# Altium schematic sheet Controller.SchDoc
size A3
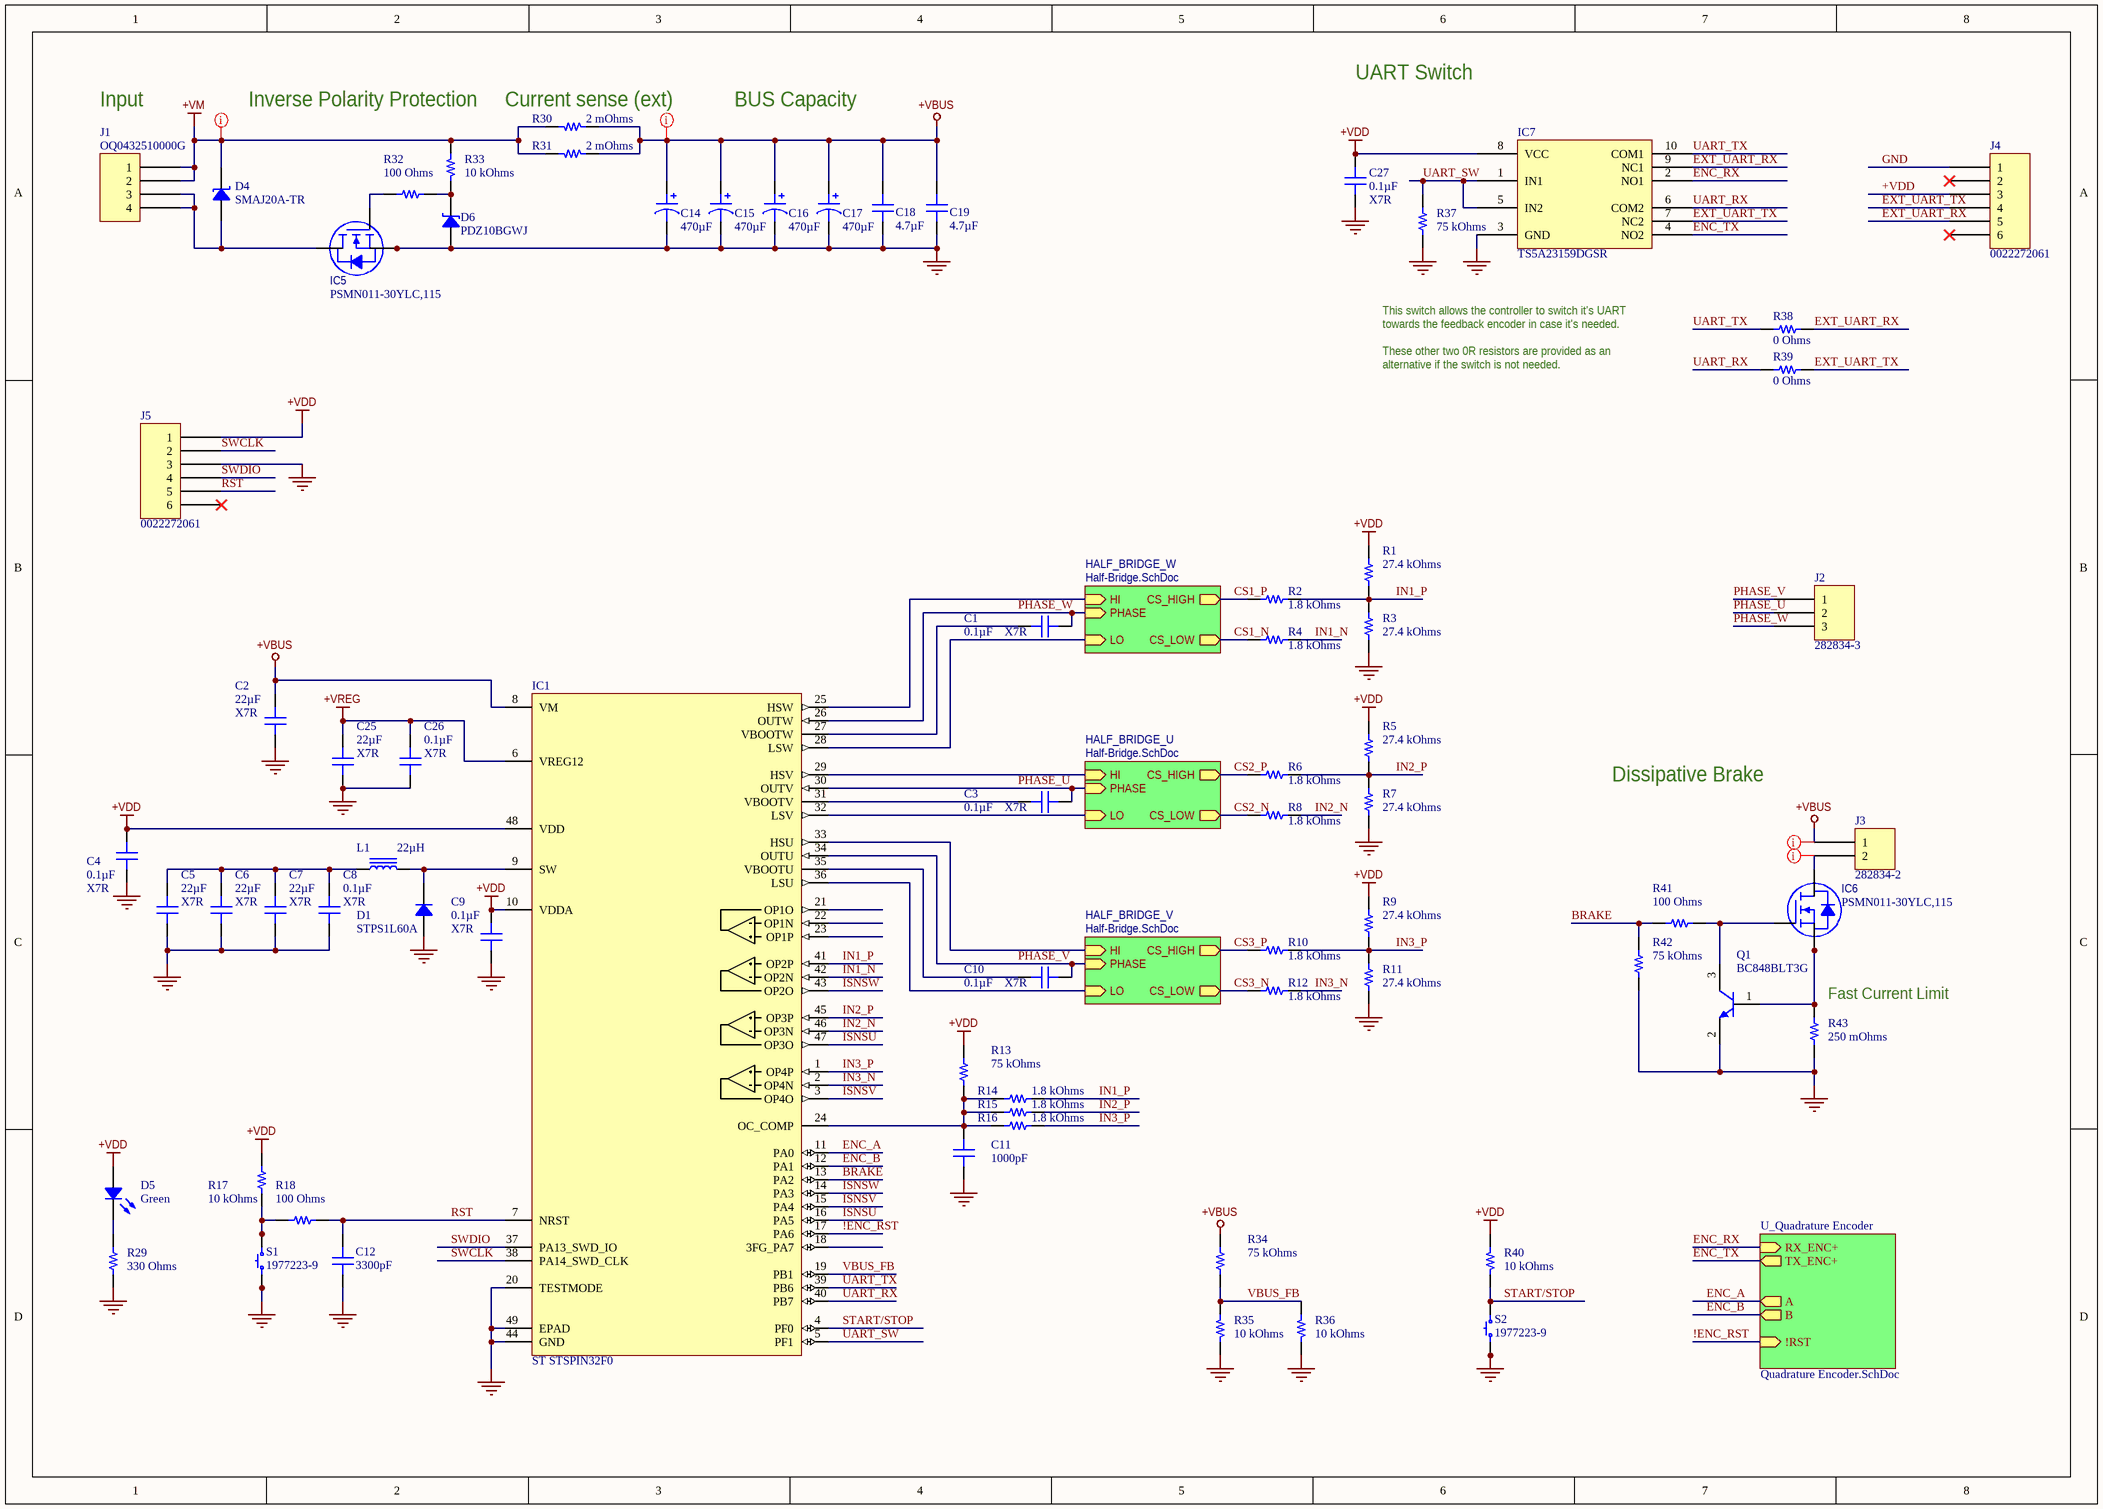
[diagram p0: Controller.SchDoc]

## Parts
C1  Temperature Coefficient: X7R  [CAP 0805_2012]  (hidden comment: 0.1µF)
C2  Temperature Coefficient: X7R  [CAP 1206_3216 - 1.8MM]  (hidden comment: 22µF)
C3  Temperature Coefficient: X7R  [CAP 0805_2012]  (hidden comment: 0.1µF)
C4  Temperature Coefficient: X7R  [CAP 0805_2012]  (hidden comment: 0.1µF)
C5  Temperature Coefficient: X7R  [CAP 1206_3216 - 1.8MM]  (hidden comment: 22µF)
C6  Temperature Coefficient: X7R  [CAP 1206_3216 - 1.8MM]  (hidden comment: 22µF)
C7  Temperature Coefficient: X7R  [CAP 1206_3216 - 1.8MM]  (hidden comment: 22µF)
C8  Temperature Coefficient: X7R  [CAP 0805_2012]  (hidden comment: 0.1µF)
C9  Temperature Coefficient: X7R  [CAP 0805_2012]  (hidden comment: 0.1µF)
C10  Temperature Coefficient: X7R  [CAP 0805_2012]  (hidden comment: 0.1µF)
C11  1000pF  [CAP 0603_1608]
C12  3300pF  [CAP 0603_1608]
C14  470µF  [CAP ALSMD 8.3MM H10.5MM]
C15  470µF  [CAP ALSMD 8.3MM H10.5MM]
C16  470µF  [CAP ALSMD 8.3MM H10.5MM]
C17  470µF  [CAP ALSMD 8.3MM H10.5MM]
C18  4.7µF  [CAP 1206_3216 - 1.8MM]
C19  4.7µF  [CAP 1206_3216 - 1.8MM]
C25  Temperature Coefficient: X7R  [CAP 1206_3216 - 1.8MM]  (hidden comment: 22µF)
C26  Temperature Coefficient: X7R  [CAP 0805_2012]  (hidden comment: 0.1µF)
C27  Temperature Coefficient: X7R  [CAP 0805_2012]  (hidden comment: 0.1µF)
D1  STPS1L60A  [DO214AC SMA]
D4  SMAJ20A-TR  [DO214AC SMA]
D5  Green  [LED 0603_1608 GREEN]
D6  PDZ10BGWJ  [SOD-123]
IC1  ST STSPIN32F0  [ST VFQFPN48EP 7x7MM]
IC5  PSMN011-30YLC,115  [NXP LFPAK56 SOT669]
IC6  PSMN011-30YLC,115  [NXP LFPAK56 SOT669]
IC7  TS5A23159DGSR  [TI MSOP-10 DGS]
J1  OQ0432510000G  [FCI 06-381-4PIN]
J2  282834-3  [TE 282834-3]
J3  282834-2  [TE 282834-2]
J4  0022272061  [MOLEX KK 0022272061]
J5  0022272061  [MOLEX KK 0022272061]
L1  22µH  [BOURNS SRN3015]
Q1  BC848BLT3G  [ON SEMI SOT-23-3]
R1  27.4 kOhms  [RES 0603_1608]
R2  1.8 kOhms  [RES 0603_1608]
R3  27.4 kOhms  [RES 0603_1608]
R4  1.8 kOhms  [RES 0603_1608]
R5  27.4 kOhms  [RES 0603_1608]
R6  1.8 kOhms  [RES 0603_1608]
R7  27.4 kOhms  [RES 0603_1608]
R8  1.8 kOhms  [RES 0603_1608]
R9  27.4 kOhms  [RES 0603_1608]
R10  1.8 kOhms  [RES 0603_1608]
R11  27.4 kOhms  [RES 0603_1608]
R12  1.8 kOhms  [RES 0603_1608]
R13  75 kOhms  [RES 0603_1608]
R14  1.8 kOhms  [RES 0603_1608]
R15  1.8 kOhms  [RES 0603_1608]
R16  1.8 kOhms  [RES 0603_1608]
R17  10 kOhms  [RES 0603_1608]
R18  100 Ohms  [RES 0603_1608]
R29  330 Ohms  [RES 0603_1608]
R30  2 mOhms  [RES 1210_3225]
R31  2 mOhms  [RES 1210_3225]
R32  100 Ohms  [RES 0603_1608]
R33  10 kOhms  [RES 0603_1608]
R34  75 kOhms  [RES 0603_1608]
R35  10 kOhms  [RES 0603_1608]
R36  10 kOhms  [RES 0603_1608]
R37  75 kOhms  [RES 0603_1608]
R38  0 Ohms  [RES 0603_1608]
R39  0 Ohms  [RES 0603_1608]
R40  10 kOhms  [RES 0603_1608]
R41  100 Ohms  [RES 0603_1608]
R42  75 kOhms  [RES 0603_1608]
R43  250 mOhms  [RES 2512_6432]
S1  1977223-9  [TE FSM4JSMA]
S2  1977223-9  [TE FSM4JSMA]

## Sub-sheets
HALF_BRIDGE_U = Half-Bridge.SchDoc: CS_HIGH (out), CS_LOW (out), HI (in), LO (in), PHASE (in)
HALF_BRIDGE_V = Half-Bridge.SchDoc: CS_HIGH (out), CS_LOW (out), HI (in), LO (in), PHASE (in)
HALF_BRIDGE_W = Half-Bridge.SchDoc: CS_HIGH (out), CS_LOW (out), HI (in), LO (in), PHASE (in)
U_Quadrature Encoder = Quadrature Encoder.SchDoc: A (out), RX_ENC+ (in), B (out), TX_ENC+ (out), !RST (in)

## Nets
+VBUS: C2.2 C14.1 C15.1 C16.1 C17.1 C18.2 C19.2 IC1.8(VM) J3.1 R30.1 R31.1 R34.2
+VDD: C4.1 C9.1 C27.1 D5.1 IC1.10(VDDA) IC1.48(VDD) IC7.8(VCC) J4.3 J5.1 R1.2 R5.2 R9.2 R13.2 R17.2 R40.2
+VM: D4.2 J1.1 J1.2 R30.2 R31.2 R33.2
+VREG: C25.2 C26.1 IC1.6(VREG12)
GND: C2.1 C4.2 C5.1 C6.1 C7.1 C8.2 C9.2 C11.1 C12.1 C14.2 C15.2 C16.2 C17.2 C18.1 C19.1 C25.1 C26.2 C27.2 D1.1 D6.1 IC1.20(TESTMODE) IC1.44(GND) IC1.49(EPAD) IC5.1(S) IC5.2(S) IC5.3(S) IC7.3(GND) J4.1 J5.3 Q1.2(E) R3.1 R7.1 R11.1 R29.1 R35.1 R36.1 R37.1 R42.1 R43.1 S1.1 S1.2 S2.1 S2.2
!ENC_RST: IC1.17(PA6) ; sheet U_Quadrature Encoder/!RST
BRAKE: IC1.13(PA2) R41.1 R42.2
CS1_N: R4.1 ; sheet HALF_BRIDGE_W/CS_LOW
CS1_P: R2.1 ; sheet HALF_BRIDGE_W/CS_HIGH
CS2_N: R8.1 ; sheet HALF_BRIDGE_U/CS_LOW
CS2_P: R6.1 ; sheet HALF_BRIDGE_U/CS_HIGH
CS3_N: R12.1 ; sheet HALF_BRIDGE_V/CS_LOW
CS3_P: R10.1 ; sheet HALF_BRIDGE_V/CS_HIGH
ENC_A: IC1.11(PA0) ; sheet U_Quadrature Encoder/A
ENC_B: IC1.12(PA1) ; sheet U_Quadrature Encoder/B
ENC_RX: IC7.2(NO1) ; sheet U_Quadrature Encoder/RX_ENC+
ENC_TX: IC7.4(NO2) ; sheet U_Quadrature Encoder/TX_ENC+
EXT_UART_RX: IC7.9(NC1) J4.5 R38.2
EXT_UART_TX: IC7.7(NC2) J4.4 R39.2
IN1_N: IC1.42(OP2N) R4.2
IN1_P: IC1.41(OP2P) R1.1 R2.2 R3.2 R14.2
IN2_N: IC1.46(OP3N) R8.2
IN2_P: IC1.45(OP3P) R5.1 R6.2 R7.2 R15.2
IN3_N: IC1.2(OP4N) R12.2
IN3_P: IC1.1(OP4P) R9.1 R10.2 R11.2 R16.2
ISNSU: IC1.16(PA5) IC1.47(OP3O)
ISNSV: IC1.3(OP4O) IC1.15(PA4)
ISNSW: IC1.14(PA3) IC1.43(OP2O)
PHASE_U: C3.1 IC1.30(OUTV) J2.2 ; sheet HALF_BRIDGE_U/PHASE
PHASE_V: C10.1 IC1.34(OUTU) J2.1 ; sheet HALF_BRIDGE_V/PHASE
PHASE_W: C1.1 IC1.26(OUTW) J2.3 ; sheet HALF_BRIDGE_W/PHASE
RST: C12.2 IC1.7(NRST) J5.5 R18.2
START/STOP: IC1.4(PF0) R40.1 S2.3 S2.4
SWCLK: IC1.38(PA14_SWD_CLK) J5.2
SWDIO: IC1.37(PA13_SWD_IO) J5.4
UART_RX: IC1.40(PB7) IC7.6(COM2) R39.1
UART_SW: IC1.5(PF1) IC7.1(IN1) IC7.5(IN2) R37.2
UART_TX: IC1.39(PB6) IC7.10(COM1) R38.1
VBUS_FB: IC1.19(PB1) R34.1 R35.2 R36.2
NetC1_2: C1.2 IC1.27(VBOOTW)
NetC3_2: C3.2 IC1.31(VBOOTV)
NetC5_2: C5.2 C6.2 C7.2 C8.1 L1.1
NetC10_2: C10.2 IC1.35(VBOOTU)
NetC11_2: C11.2 IC1.24(OC_COMP) R13.1 R14.1 R15.1 R16.1
NetD1_2: D1.2 IC1.9(SW) L1.2
NetD4_1: D4.1 IC5.5(D) J1.3 J1.4
NetD5_2: D5.2 R29.2
NetD6_2: D6.2 R32.2 R33.1
NetIC1_25: IC1.25(HSW) ; sheet HALF_BRIDGE_W/HI
NetIC1_28: IC1.28(LSW) ; sheet HALF_BRIDGE_W/LO
NetIC1_29: IC1.29(HSV) ; sheet HALF_BRIDGE_U/HI
NetIC1_32: IC1.32(LSV) ; sheet HALF_BRIDGE_U/LO
NetIC1_33: IC1.33(HSU) ; sheet HALF_BRIDGE_V/HI
NetIC1_36: IC1.36(LSU) ; sheet HALF_BRIDGE_V/LO
NetIC5_4: IC5.4(G) R32.1
NetIC6_1: IC6.1(S) IC6.2(S) IC6.3(S) Q1.1(B) R43.2
NetIC6_4: IC6.4(G) Q1.3(C) R41.2
NetIC6_5: IC6.5(D) J3.2
NetR17_1: R17.1 R18.1 S1.3 S1.4

Not connected (* = marked no-connect by the designer): IC1 18(3FG_PA7) 21(OP1O) 22(OP1N) 23(OP1P); J4 2* 6*; J5 6*

## Layout directives
net class HIGH_V: +VBUS, +VM, NetIC6_5

## Notes on the sheet
- Input
- (near R30) Inverse Polarity Protection
- (near R30) Current sense (ext)
- BUS Capacity
- UART Switch
- This switch allows the controller to switch it's UART towards the feedback encoder in case it's needed.
  These other two 0R resistors are provided as an alternative if the switch is not needed.
- Dissipative Brake
- (near R43) Fast Current Limit

## Library data of the parts
C1 C3 C4 C8-C10 C26 C27 = CL21B104KBCWPNC: CAP CER 0.1UF 50V X7R 0805; Manufacturer: Samsung Electro-Mechanics; Tolerance: ±10%; Part Number: CL21B104KBCWPNC; Value: 0.1µF; Applications: Automotive; Capacitance: 0.1µF; ComponentLink1Description: Datasheet; ComponentLink1URL: http://www.samsungsem.com/kr/support/product-search/mlcc/CL21B104KBCWPNC.jsp; ComponentLink2Description: DigiKey Link; ComponentLink2URL: http://digikey.com/product-detail/en/samsung-electro-mechanics/CL21B104KBCWPNC/1276-6557-1-ND/5961416; Device Package: 0805 (2012 Metric); Features: Open Mode; LastUpdated: 8/13/2020 10:31:23 AM; Lifecycle Status: Active; Minimum Order: 1; Mounting Type: Surface Mount, MLCC; Operating Temperature: -55°C ~ 125°C; Package / Case: 0805 (2012 Metric); Packaging: TapeAndReel; PartId: 6329; Part Status: Active; Price: 0.01; Ratings: AEC-Q200; Series: CL; Size / Dimension: 0.079" L x 0.049" W (2.00mm x 1.25mm); Supplier 1: DigiKey; Supplier Part Number 1: 1276-6557-1-ND; Thickness (Max): 0.053" (1.35mm)
C2 C5-C7 C25 = GCM31CR70J226KE23L: CAP CER 22UF 6.3V X7R 1206; Manufacturer: Murata Electronics; Tolerance: ±10%; Part Number: GCM31CR70J226KE23L; Value: 22µF; Applications: Automotive; Capacitance: 22µF; ComponentLink1Description: Datasheet; ComponentLink1URL: https://www.murata.com/~/media/webrenewal/support/library/catalog/products/capacitor/mlcc/c03e.ashx?la=en-us; ComponentLink2Description: DigiKey Link; ComponentLink2URL: http://digikey.com/product-detail/en/murata-electronics/GCM31CR70J226KE23L/490-4843-1-ND/1763981; Device Package: 1206 (3216 Metric); LastUpdated: 9/2/2020 1:05:42 AM; Lifecycle Status: Active; Minimum Order: 1; Mounting Type: Surface Mount, MLCC; Operating Temperature: -55°C ~ 125°C; Package / Case: 1206 (3216 Metric); Packaging: TapeAndReel; PartId: 19505; Part Status: Active; Price: 0.23; Ratings: AEC-Q200; Series: GCM; Size / Dimension: 0.126" L x 0.063" W (3.20mm x 1.60mm); Supplier 1: DigiKey; Supplier Part Number 1: 490-4843-1-ND; Thickness (Max): 0.071" (1.80mm); Voltage - Rated: 6.3V
C11 = C0603C102K4RECAUTO: CAP CER 0603 1NF 16V X7R 10%; Manufacturer: KEMET; Part Number: C0603C102K4RECAUTO; Value: 1000pF; Applications: Automotive, ESD Protection; Capacitance: 1000pF; ComponentLink1Description: Datasheet; ComponentLink1URL: https://api.kemet.com/component-edge/download/datasheet/C0603C102K4RECAUTO.pdf; ComponentLink2Description: DigiKey Link; ComponentLink2URL: http://digikey.com/product-detail/en/kemet/C0603C102K4RECAUTO/399-17878-1-ND/8640545; Device Package: 0603 (1608 Metric); LastUpdated: 9/2/2020 1:03:36 AM; Lifecycle Status: Active; Minimum Order: 1; Mounting Type: Surface Mount, MLCC; Operating Temperature: -55°C ~ 125°C; Package / Case: 0603 (1608 Metric); Packaging: TapeAndReel; PartId: 2316; Part Status: Active; Price: 0.02; Ratings: AEC-Q200; Series: ESD SMD Auto X7R; Size / Dimension: 0.063" L x 0.031" W (1.60mm x 0.80mm); Supplier 1: DigiKey; Supplier Part Number 1: 399-17878-1-ND; Temperature Coefficient: X7R; Thickness (Max): 0.034" (0.87mm); Tolerance: ±10%; Voltage - Rated: 16V
C12 = C0603C332J3GAC7867: CAP CER 3300PF 25V NP0 0603; Manufacturer: KEMET; Temperature Coefficient: C0G, NP0; Tolerance: ±5%; Part Number: C0603C332J3GAC7867; Value: 3300pF; Applications: General Purpose; Capacitance: 3300pF; ComponentLink1Description: Datasheet; ComponentLink1URL: https://api.kemet.com/component-edge/download/datasheet/C0603C332J3GACTU.pdf; ComponentLink2Description: DigiKey Link; ComponentLink2URL: http://digikey.com/product-detail/en/kemet/C0603C332J3GAC7867/399-15394-1-ND/7386792; Device Package: 0603 (1608 Metric); Features: Low ESL; LastUpdated: 9/2/2020 1:03:35 AM; Lifecycle Status: Active; Minimum Order: 1; Mounting Type: Surface Mount, MLCC; Operating Temperature: -55°C ~ 125°C; Package / Case: 0603 (1608 Metric); Packaging: TapeAndReel; PartId: 2363; Part Status: Active; Price: 0.08; Series: SMD Comm C0G; Size / Dimension: 0.063" L x 0.031" W (1.60mm x 0.80mm); Supplier 1: DigiKey; Supplier Part Number 1: 399-15394-1-ND; Thickness (Max): 0.034" (0.87mm); Voltage - Rated: 25V
C14-C17 = 25TPV470M8X10.5: CAP ALUM 470UF 20% 25V SMD; Manufacturer: Rubycon; ESR (Equivalent Series Resistance): 80mOhm @ 100kHz; Lifetime @ Temp.: 2000 Hrs @ 105°C; Polarization: Polar; Ripple Current @ High Frequency: 850mA @ 100kHz; Ripple Current @ Low Frequency: 510mA @ 120Hz; Surface Mount Land Size: 0.327" L x 0.327" W (8.30mm x 8.30mm); Part Number: 25TPV470M8X10.5; Applications: Automotive; Capacitance: 470µF; ComponentLink1Description: Datasheet; ComponentLink1URL: http://www.rubycon.co.jp/en/catalog/e_pdfs/aluminum/e_TPV.pdf; ComponentLink2Description: DigiKey Link; ComponentLink2URL: http://digikey.com/product-detail/en/rubycon/25TPV470M8X10.5/1189-4137-1-ND/9083593; Device Package: Radial, Can - SMD; Height - Seated (Max): 0.413" (10.50mm); LastUpdated: 9/2/2020 1:25:13 AM; Lifecycle Status: Active; Minimum Order: 1; Mounting Type: Surface Mount; Operating Temperature: -55°C ~ 105°C; Package / Case: Radial, Can - SMD; Packaging: TapeAndReel; PartId: 7752; Part Status: Active; Price: 0.42; Ratings: AEC-Q200; Series: TPV; Size / Dimension: 0.315" Dia (8.00mm); Supplier 1: DigiKey; Supplier Part Number 1: 1189-4137-1-ND; Tolerance: ±20%; Value: 470µF; Voltage - Rated: 25V
C18 C19 = GCM31CR71E475KA55L: CAP CER 4.7UF 25V X7R 1206; Manufacturer: Murata Electronics; Tolerance: ±10%; Part Number: GCM31CR71E475KA55L; Value: 4.7µF; Applications: Automotive; Capacitance: 4.7µF; ComponentLink1Description: Datasheet; ComponentLink1URL: https://www.murata.com/~/media/webrenewal/support/library/catalog/products/capacitor/mlcc/c03e.ashx?la=en-us; ComponentLink2Description: DigiKey Link; ComponentLink2URL: http://digikey.com/product-detail/en/murata-electronics/GCM31CR71E475KA55L/490-4794-1-ND/1641713; Device Package: 1206 (3216 Metric); LastUpdated: 9/2/2020 1:05:30 AM; Lifecycle Status: Active; Minimum Order: 1; Mounting Type: Surface Mount, MLCC; Operating Temperature: -55°C ~ 125°C; Package / Case: 1206 (3216 Metric); Packaging: TapeAndReel; PartId: 21968; Part Status: Active; Price: 0.16; Ratings: AEC-Q200; Series: GCM; Size / Dimension: 0.126" L x 0.063" W (3.20mm x 1.60mm); Supplier 1: DigiKey; Supplier Part Number 1: 490-4794-1-ND; Temperature Coefficient: X7R; Thickness (Max): 0.071" (1.80mm); Voltage - Rated: 25V
D1 = STPS1L60A: DIODE SCHOTTKY 60V 1A SMA; Manufacturer: STMicroelectronics; Current - Reverse Leakage @ Vr: 50µA @ 60V; Speed: Fast Recovery =< 500ns, > 200mA (Io); Voltage - Forward (Vf) (Max) @ If: 570mV @ 1A; Part Number: STPS1L60A; ComponentLink1Description: Datasheet; ComponentLink1URL: http://www.st.com/content/ccc/resource/technical/document/datasheet/group1/7e/b6/29/85/66/15/45/f3/CD00002285/files/CD00002285.pdf/jcr:content/translations/en.CD00002285.pdf; ComponentLink2Description: DigiKey Link; ComponentLink2URL: http://digikey.com/product-detail/en/stmicroelectronics/STPS1L60A/497-2463-1-ND/603845; Current - Average Rectified (Io): 1A; Diode Type: Schottky; LastUpdated: 9/2/2020 1:19:02 AM; Lifecycle Status: Active; Minimum Order: 1; Mounting Type: Surface Mount; Operating Temperature - Junction: 150°C (Max); Package / Case: DO-214AC, SMA; Packaging: TapeAndReel; PartId: 2097; Part Status: Active; Price: 0.14; Series: -; Supplier 1: DigiKey; Supplier Part Number 1: 497-2463-1-ND; Supplier Device Package: SMA (DO-214AC); Voltage - DC Reverse (Vr) (Max): 60V
D4 = SMAJ20A-TR: TVS DIODE 20V 42.8V SMA; Manufacturer: STMicroelectronics; Current - Peak Pulse (10/1000µs): 54A (8/20µs); Power Line Protection: No; Power - Peak Pulse: 400W; Type: Zener; Unidirectional Channels: 1; Voltage - Breakdown (Min): 22.2V; Part Number: SMAJ20A-TR; Applications: General Purpose; ComponentLink1Description: Datasheet; ComponentLink1URL: http://www.st.com/content/ccc/resource/technical/document/datasheet/ff/c0/80/cc/19/4c/45/af/CD00001333.pdf/files/CD00001333.pdf/_jcr_content/translations/en.CD00001333.pdf; ComponentLink2Description: DigiKey Link; ComponentLink2URL: http://digikey.com/product-detail/en/stmicroelectronics/SMAJ20A-TR/497-16189-1-ND/5764818; LastUpdated: 9/2/2020 1:20:15 AM; Lifecycle Status: Active; Minimum Order: 1; Mounting Type: Surface Mount; Operating Temperature: -55°C ~ 150°C (TJ); Package / Case: DO-214AC, SMA; Packaging: TapeAndReel; PartId: 5821; Part Status: Active; Price: 0.09; Series: SMAJ, TRANSIL™; Supplier 1: DigiKey; Supplier Part Number 1: 497-16189-1-ND; Supplier Device Package: SMA (DO-214AC); Voltage - Clamping (Max) @ Ipp: 42.8V; Voltage - Reverse Standoff (Typ): 20V
D5 = SML-D12P8WT86: LED GREEN DIFFUSED 0603 SMD; Manufacturer: Rohm Semiconductor; Configuration: Standard; Current - Test: 20mA; Lens Color: White; Lens Size: 1.20mm x 0.80mm; Lens Style: Rectangle with Flat Top; Millicandela Rating: 6.3mcd; Voltage - Forward (Vf) (Typ): 2.2V; Wavelength - Dominant: 560nm; Part Number: SML-D12P8WT86; Color: Green; ComponentLink1Description: Datasheet; ComponentLink1URL: https://www.rohm.com/datasheet/SML-D12V8W; ComponentLink2Description: DigiKey Link; ComponentLink2URL: http://digikey.com/product-detail/en/rohm-semiconductor/SML-D12P8WT86/511-1579-1-ND/1641811; Device Package: 0603 (1608 Metric); Height (Max): 0.65mm; LastUpdated: 9/2/2020 1:20:43 AM; Lens Transparency: Diffused; Lifecycle Status: Active; Minimum Order: 1; Mounting Type: Surface Mount; Package / Case: 0603 (1608 Metric); Packaging: TapeAndReel; PartId: 616; Part Status: Active; Price: 0.06; Series: EXCELED™; Size / Dimension: 1.60mm L x 0.80mm W; Supplier 1: DigiKey; Supplier Part Number 1: 511-1579-1-ND; Supplier Device Package: 0603 (1608 Metric); Value: Green
D6 = PDZ10BGWJ: DIODE ZENER 10V 365MW SOD123; Manufacturer: Nexperia USA Inc.; Current - Reverse Leakage @ Vr: 100nA @ 7V; Impedance (Max) (Zzt): 10 Ohms; Tolerance: ±2.2%; Voltage - Forward (Vf) (Max) @ If: 1.1V @ 100mA; Part Number: PDZ10BGWJ; ComponentLink1Description: Datasheet; ComponentLink1URL: https://assets.nexperia.com/documents/data-sheet/PDZ-GW_SER.pdf; ComponentLink2Description: DigiKey Link; ComponentLink2URL: http://digikey.com/product-detail/en/nexperia-usa-inc/PDZ10BGWJ/1727-7762-1-ND/8640743; LastUpdated: 9/2/2020 1:19:24 AM; Lifecycle Status: Active; Minimum Order: 1; Mounting Type: Surface Mount; Operating Temperature: 150°C (TJ); Package / Case: SOD-123; Packaging: TapeAndReel; PartId: 2391; Part Status: Active; Power - Max: 365mW; Price: 0.02; Series: Automotive, AEC-Q101, PDZ-GW; Supplier 1: DigiKey; Supplier Part Number 1: 1727-7762-1-ND; Supplier Device Package: SOD-123; Voltage - Zener (Nom) (Vz): 10V
IC5 IC6 = PSMN011-30YLC,115: MOSFET N-CH 30V 37A LFPAK; Manufacturer: Nexperia USA Inc.; Current - Continuous Drain (Id) @ 25°C: 37A (Tc); Drive Voltage (Max Rds On,  Min Rds On): 4.5V, 10V; FET Type: N-Channel; Gate Charge (Qg) (Max) @ Vgs: 10.3nC @ 10V; Input Capacitance (Ciss) (Max) @ Vds: 641pF @ 15V; Power Dissipation (Max): 29W (Tc); Rds On (Max) @ Id, Vgs: 11.6mOhm @ 10A, 10V; Vgs (Max): ±20V; Vgs(th) (Max) @ Id: 1.95V @ 1mA; Part Number: PSMN011-30YLC,115; ComponentLink1Description: Datasheet; ComponentLink1URL: https://assets.nexperia.com/documents/data-sheet/PSMN011-30YLC.pdf; ComponentLink2Description: DigiKey Link; ComponentLink2URL: http://digikey.com/product-detail/en/nexperia-usa-inc/PSMN011-30YLC115/1727-6495-1-ND/2785363; Device Package: SC-100, SOT-669; Drain to Source Voltage (Vdss): 30V; LastUpdated: 2/4/2020 3:06:20 AM; Lifecycle Status: Active; Minimum Order: 1; Mounting Type: Surface Mount; Operating Temperature: -55°C ~ 175°C (TJ); Package / Case: SC-100, SOT-669; Packaging: TapeAndReel; Part Status: Active; Price: 0.19; Series: -; Supplier 1: DigiKey; Supplier Part Number 1: 1727-6495-1-ND; Supplier Device Package: LFPAK56, Power-SO8; Technology: MOSFET (Metal Oxide)
IC7 = TS5A23159DGSR: IC SWITCH SPDT DUAL 10VSSOP; Manufacturer: Texas Instruments; -3db Bandwidth: 100MHz; Channel Capacitance (CS(off), CD(off)): 18pF; Channel-to-Channel Matching (ΔRon): 50mOhm; Charge Injection: -7pC; Crosstalk: -64dB @ 1MHz; Current - Leakage (IS(off)) (Max): 20nA; Multiplexer/Demultiplexer Circuit: 2:1; Number of Circuits: 2; On-State Resistance (Max): 900mOhm; Switch Time (Ton, Toff) (Max): 13ns, 8ns; Voltage - Supply, Single (V+): 1.65V ~ 5.5V; Part Number: TS5A23159DGSR; ComponentLink1Description: Datasheet; ComponentLink1URL: http://www.ti.com/general/docs/suppproductinfo.tsp?distId=10&gotoUrl=http%3A%2F%2Fwww.ti.com%2Flit%2Fgpn%2Fts5a23159; ComponentLink2Description: DigiKey Link; ComponentLink2URL: //digikey.com/product-detail/en/texas-instruments/TS5A23159DGSR/296-18598-2-ND/862569; Device Package: 10-TFSOP, 10-MSOP (0.118", 3.00mm Width); LastUpdated: 12/9/2019 2:22:03 PM; Lifecycle Status: 0; Minimum Order: 1; Operating Temperature: -40°C ~ 85°C (TA); Package / Case: 10-TFSOP, 10-MSOP (0.118", 3.00mm Width); Packaging: TapeAndReel; PartId: 1; Part Status: Active; Price: 0.37; Series: -; Supplier 1: DigiKey; Supplier Part Number 1: 296-18598-2-ND; Supplier Device Package: 10-VSSOP; Switch Circuit: SPDT
J1 = OQ0432510000G: TERM BLOCK HDR 4POS 90DEG 3.81MM; Manufacturer: Amphenol Anytek; Current - UL: 10A; Header Orientation: 90°, Right Angle; Number of Levels: 1; Number of Positions: 4; Pitch: 0.150" (3.81mm); Voltage - UL: 300V; Part Number: OQ0432510000G; Color: Green; ComponentLink1Description: Datasheet; ComponentLink1URL: http://portal.fciconnect.com/Comergent//fci/drawing/oqxx32x100j0g.pdf; ComponentLink2Description: DigiKey Link; ComponentLink2URL: //digikey.com/product-detail/en/amphenol-anytek/OQ0432510000G/609-3821-ND/2261267; Contact Mating Finish: Tin; LastUpdated: 12/16/2019 7:15:03 PM; Lifecycle Status: 0; Minimum Order: 1; Mounting Type: Through Hole; Operating Temperature: -40°C ~ 115°C; Packaging: Bulk; Part Status: Active; Positions Per Level: 4; Price: 0.71; Series: 06-381; Supplier 1: DigiKey; Supplier Part Number 1: 609-3821-ND; Termination Style: Solder; Type: Header, Male Pins, Shrouded (4 Side)
J2 = 282834-3: TERM BLK 3P SIDE ENT 2.54MM PCB; Manufacturer: TE Connectivity AMP Connectors; Current: 10A; Mating Orientation: Horizontal with Board; Number of Levels: 1; Pitch: 0.100" (2.54mm); Positions Per Level: 3; Voltage: 150V; Wire Gauge: 16-30 AWG; Wire Termination: Screw - Rising Cage Clamp; Part Number: 282834-3; Color: Green; ComponentLink1Description: Datasheet; ComponentLink1URL: https://www.te.com/commerce/DocumentDelivery/DDEController?Action=srchrtrv&DocNm=282834&DocType=Customer+Drawing&DocLang=English; ComponentLink2Description: DigiKey Link; ComponentLink2URL: http://digikey.com/product-detail/en/te-connectivity-amp-connectors/282834-3/A98334-ND/1153264; LastUpdated: 1/15/2020 4:15:50 AM; Lifecycle Status: Active; Minimum Order: 1; Mounting Type: Through Hole; Packaging: Bulk; Part Status: Active; Price: 2.01; Series: Buchanan; Supplier 1: DigiKey; Supplier Part Number 1: A98334-ND
J3 = 282834-2: TERM BLK 2P SIDE ENT 2.54MM PCB; Manufacturer: TE Connectivity AMP Connectors; Current: 10A; Mating Orientation: Horizontal with Board; Number of Levels: 1; Pitch: 0.100" (2.54mm); Positions Per Level: 2; Voltage: 150V; Wire Gauge: 16-30 AWG; Wire Termination: Screw - Rising Cage Clamp; Part Number: 282834-2; Color: Green; ComponentLink1Description: Datasheet; ComponentLink1URL: https://www.te.com/commerce/DocumentDelivery/DDEController?Action=srchrtrv&DocNm=282834&DocType=Customer+Drawing&DocLang=English; ComponentLink2Description: DigiKey Link; ComponentLink2URL: http://digikey.com/product-detail/en/te-connectivity-amp-connectors/282834-2/A98333-ND/1150135; LastUpdated: 1/15/2020 4:15:38 AM; Lifecycle Status: Active; Minimum Order: 1; Mounting Type: Through Hole; Packaging: Bulk; Part Status: Active; Price: 0.88; Series: Buchanan; Supplier 1: DigiKey; Supplier Part Number 1: A98333-ND
J4 J5 = 0022272061: CONN HEADER VERT 6POS 2.54MM; Manufacturer: Molex; Contact Length - Mating: 0.295" (7.49mm); Contact Length - Post: 0.140" (3.56mm); Material Flammability Rating: UL94 V-0; Number of Positions: 6; Number of Positions Loaded: All; Overall Contact Length: 0.560" (14.22mm); Pitch - Mating: 0.100" (2.54mm); Shrouding: Shrouded - 1 Wall; Style: Board to Cable/Wire; Part Number: 0022272061; ComponentLink1Description: Datasheet; ComponentLink1URL: https://www.molex.com/pdm_docs/sd/022272061_sd.pdf; ComponentLink2Description: DigiKey Link; ComponentLink2URL: http://digikey.com/product-detail/en/molex/0022272061/WM4115-ND/1130581; Connector Type: Header; Contact Finish - Mating: Tin; Contact Finish - Post: Tin; Contact Finish Thickness - Mating: 100.0µin (2.54µm); Contact Material: Brass; Contact Shape: Square; Contact Type: Male Pin; Fastening Type: Friction Lock; Insulation Color: Natural; Insulation Height: 0.461" (11.70mm); Insulation Material: Polyamide (PA), Nylon; LastUpdated: 1/12/2020 11:52:24 PM; Lifecycle Status: Active; Minimum Order: 1; Mounting Type: Through Hole; Number of Rows: 1; Packaging: Bulk; PartId: 80; Part Status: Active; Price: 0.49; Series: KK 6410; Supplier 1: DigiKey; Supplier Part Number 1: WM4115-ND; Termination: Solder
L1 = SRN3015-220M: FIXED IND 22UH 600MA 622MOHM SMD; Manufacturer: Bourns Inc.; Current - Saturation: 580mA; DC Resistance (DCR): 622mOhm Max; Frequency - Self Resonant: 28MHz; Inductance Frequency - Test: 1MHz; Material - Core: Ferrite; Q @ Freq: 17 @ 2.52MHz; Shielding: Semi-Shielded; Tolerance: ±20%; Type: Wirewound; Part Number: SRN3015-220M; ComponentLink1Description: Datasheet; ComponentLink1URL: https://www.bourns.com/docs/Product-Datasheets/SRN3015.pdf; ComponentLink2Description: DigiKey Link; ComponentLink2URL: http://digikey.com/product-detail/en/bourns-inc/SRN3015-220M/SRN3015-220MCT-ND/2756152; Current Rating (Amps): 600mA; Device Package: Nonstandard; Height - Seated (Max): 0.059" (1.50mm); Inductance: 22µH; LastUpdated: 9/2/2020 1:30:19 AM; Lifecycle Status: Active; Minimum Order: 1; Mounting Type: Surface Mount; Operating Temperature: -40°C ~ 125°C; Package / Case: Nonstandard; Packaging: TapeAndReel; PartId: 3545; Part Status: Active; Price: 0.17; Series: SRN3015; Size / Dimension: 0.118" L x 0.118" W (3.00mm x 3.00mm); Supplier 1: DigiKey; Supplier Part Number 1: SRN3015-220MCT-ND; Value: 22µH
Q1 = BC848BLT3G: TRANS NPN 30V 0.1A SOT-23; Manufacturer: ON Semiconductor; Current - Collector Cutoff (Max): 15nA (ICBO); Current - Collector (Ic) (Max): 100mA; DC Current Gain (hFE) (Min) @ Ic, Vce: 200 @ 2mA, 5V; Frequency - Transition: 100MHz; Power - Max: 300mW; Vce Saturation (Max) @ Ib, Ic: 600mV @ 5mA, 100mA; Part Number: BC848BLT3G; ComponentLink1Description: Datasheet; ComponentLink1URL: http://www.onsemi.com/pub/Collateral/BC846ALT1-D.PDF; ComponentLink2Description: DigiKey Link; ComponentLink2URL: http://digikey.com/product-detail/en/on-semiconductor/BC848BLT3G/BC848BLT3GOSCT-ND/4927884; LastUpdated: 9/2/2020 1:30:08 AM; Lifecycle Status: Active; Minimum Order: 1; Mounting Type: Surface Mount; Operating Temperature: -55°C ~ 150°C (TJ); Package / Case: TO-236-3, SC-59, SOT-23-3; Packaging: TapeAndReel; PartId: 136; Part Status: Active; Price: 0.01; Series: -; Supplier 1: DigiKey; Supplier Part Number 1: BC848BLT3GOSCT-ND; Supplier Device Package: SOT-23-3 (TO-236); Transistor Type: NPN; Voltage - Collector Emitter Breakdown (Max): 30V
R1 R3 R5 R7 R9 R11 = ERJ-3EKF2742V: RES SMD 27.4K OHM 1% 1/10W 0603; Manufacturer: Panasonic Electronic Components; Power (Watts): 0.1W, 1/10W; Temperature Coefficient: ±100ppm/°C; Part Number: ERJ-3EKF2742V; Value: 27.4 kOhms; ComponentLink1Description: Datasheet; ComponentLink1URL: https://industrial.panasonic.com/cdbs/www-data/pdf/RDA0000/AOA0000C304.pdf; ComponentLink2Description: DigiKey Link; ComponentLink2URL: http://digikey.com/product-detail/en/panasonic-electronic-components/ERJ-3EKF2742V/P27.4KHCT-ND/198290; Composition: Thick Film; Device Package: 0603 (1608 Metric); Features: Automotive AEC-Q200; Height - Seated (Max): 0.022" (0.55mm); LastUpdated: 8/13/2020 10:36:27 AM; Lifecycle Status: Active; Minimum Order: 1; Number of Terminations: 2; Operating Temperature: -55°C ~ 155°C; Package / Case: 0603 (1608 Metric); Packaging: TapeAndReel; PartId: 26011; Part Status: Active; Price: 0.01; Ratings: AEC-Q200; Resistance: 27.4 kOhms; Series: ERJ; Size / Dimension: 0.063" L x 0.031" W (1.60mm x 0.80mm); Supplier 1: DigiKey; Supplier Part Number 1: P27.4KHCT-ND; Supplier Device Package: 0603; Tolerance: ±1%
R2 R4 R6 R8 R10 R12 R14-R16 = ERJ-PA3F1801V: RES SMD 1.8K OHM 1% 1/4W 0603; Manufacturer: Panasonic Electronic Components; Power (Watts): 0.25W, 1/4W; Temperature Coefficient: ±100ppm/°C; Part Number: ERJ-PA3F1801V; Value: 1.8 kOhms; ComponentLink1Description: Datasheet; ComponentLink1URL: https://industrial.panasonic.com/cdbs/www-data/pdf/RDO0000/AOA0000C331.pdf; ComponentLink2Description: DigiKey Link; ComponentLink2URL: http://digikey.com/product-detail/en/panasonic-electronic-components/ERJ-PA3F1801V/P1.8KBYCT-ND/5036145; Composition: Thick Film; Device Package: 0603 (1608 Metric); Features: Automotive AEC-Q200, Pulse Withstanding; Height - Seated (Max): 0.022" (0.55mm); LastUpdated: 8/13/2020 10:36:29 AM; Lifecycle Status: Active; Minimum Order: 1; Number of Terminations: 2; Operating Temperature: -55°C ~ 155°C; Package / Case: 0603 (1608 Metric); Packaging: TapeAndReel; PartId: 25380; Part Status: Active; Price: 0.02; Ratings: AEC-Q200; Resistance: 1.8 kOhms; Series: ERJ; Size / Dimension: 0.063" L x 0.031" W (1.60mm x 0.80mm); Supplier 1: DigiKey; Supplier Part Number 1: P1.8KBYCT-ND; Supplier Device Package: 0603; Tolerance: ±1%
R13 R34 R37 R42 = ERJ-3EKF7502V: RES SMD 75K OHM 1% 1/10W 0603; Manufacturer: Panasonic Electronic Components; Power (Watts): 0.1W, 1/10W; Temperature Coefficient: ±100ppm/°C; Part Number: ERJ-3EKF7502V; Value: 75 kOhms; ComponentLink1Description: Datasheet; ComponentLink1URL: https://industrial.panasonic.com/cdbs/www-data/pdf/RDA0000/AOA0000C304.pdf; ComponentLink2Description: DigiKey Link; ComponentLink2URL: http://digikey.com/product-detail/en/panasonic-electronic-components/ERJ-3EKF7502V/P75.0KHCT-ND/198503; Composition: Thick Film; Device Package: 0603 (1608 Metric); Features: Automotive AEC-Q200; Height - Seated (Max): 0.022" (0.55mm); LastUpdated: 9/2/2020 1:10:23 AM; Lifecycle Status: Active; Minimum Order: 1; Number of Terminations: 2; Operating Temperature: -55°C ~ 155°C; Package / Case: 0603 (1608 Metric); Packaging: TapeAndReel; PartId: 5652; Part Status: Active; Price: 0.01; Ratings: AEC-Q200; Resistance: 75 kOhms; Series: ERJ; Size / Dimension: 0.063" L x 0.031" W (1.60mm x 0.80mm); Supplier 1: DigiKey; Supplier Part Number 1: P75.0KHCT-ND; Supplier Device Package: 0603; Tolerance: ±1%
R17 R33 R35 R36 R40 = ESR03EZPF1002: RES SMD 10K OHM 1% 1/4W 0603; Manufacturer: Rohm Semiconductor; Power (Watts): 0.25W, 1/4W; Temperature Coefficient: ±100ppm/°C; Part Number: ESR03EZPF1002; Value: 10 kOhms; ComponentLink1Description: Datasheet; ComponentLink1URL: https://www.rohm.com/datasheet/ESR01MZPF/esr-e; ComponentLink2Description: DigiKey Link; ComponentLink2URL: http://digikey.com/product-detail/en/rohm-semiconductor/ESR03EZPF1002/RHM10KADCT-ND/1983753; Composition: Thick Film; Device Package: 0603 (1608 Metric); Features: Automotive AEC-Q200, Pulse Withstanding; Height - Seated (Max): 0.022" (0.55mm); LastUpdated: 9/2/2020 1:10:23 AM; Lifecycle Status: Active; Minimum Order: 1; Number of Terminations: 2; Operating Temperature: -55°C ~ 155°C; Package / Case: 0603 (1608 Metric); Packaging: TapeAndReel; PartId: 5466; Part Status: Active; Price: 0.01; Ratings: AEC-Q200; Resistance: 10 kOhms; Series: ESR; Size / Dimension: 0.063" L x 0.031" W (1.60mm x 0.80mm); Supplier 1: DigiKey; Supplier Part Number 1: RHM10KADCT-ND; Supplier Device Package: 0603; Tolerance: ±1%
R18 R32 R41 = RNCP0603FTD100R: RES 100 OHM 1% 1/8W 0603; Manufacturer: Stackpole Electronics Inc; Power (Watts): 0.125W, 1/8W; Temperature Coefficient: ±100ppm/°C; Part Number: RNCP0603FTD100R; Value: 100 Ohms; ComponentLink1Description: Datasheet; ComponentLink1URL: https://www.seielect.com/catalog/sei-rncp.pdf; ComponentLink2Description: DigiKey Link; ComponentLink2URL: http://digikey.com/product-detail/en/stackpole-electronics-inc/RNCP0603FTD100R/RNCP0603FTD100RCT-ND/2240425; Composition: Thin Film; Device Package: 0603 (1608 Metric); Features: Anti-Sulfur, Moisture Resistant; Height - Seated (Max): 0.020" (0.50mm); LastUpdated: 9/2/2020 1:10:23 AM; Lifecycle Status: Active; Minimum Order: 1; Number of Terminations: 2; Operating Temperature: -55°C ~ 155°C; Package / Case: 0603 (1608 Metric); Packaging: TapeAndReel; PartId: 5692; Part Status: Active; Price: 0.01; Resistance: 100 Ohms; Series: RNCP; Size / Dimension: 0.059" L x 0.031" W (1.50mm x 0.80mm); Supplier 1: DigiKey; Supplier Part Number 1: RNCP0603FTD100RCT-ND; Supplier Device Package: 0603; Tolerance: ±1%
R29 = CRGH0603F330R: RES SMD 330 OHM 1% 1/5W 0603; Manufacturer: TE Connectivity Passive Product; Power (Watts): 0.2W, 1/5W; Temperature Coefficient: ±100ppm/°C; Part Number: CRGH0603F330R; Value: 330 Ohms; ComponentLink1Description: Datasheet; ComponentLink1URL: https://www.te.com/commerce/DocumentDelivery/DDEController?Action=srchrtrv&DocNm=1773204-1&DocType=DS&DocLang=English; ComponentLink2Description: DigiKey Link; ComponentLink2URL: http://digikey.com/product-detail/en/te-connectivity-passive-product/CRGH0603F330R/A129541CT-ND/8566745; Composition: Thick Film; Device Package: 0603 (1608 Metric); Height - Seated (Max): 0.022" (0.55mm); LastUpdated: 9/2/2020 1:10:23 AM; Lifecycle Status: Active; Minimum Order: 1; Number of Terminations: 2; Operating Temperature: -55°C ~ 155°C; Package / Case: 0603 (1608 Metric); Packaging: TapeAndReel; PartId: 5733; Part Status: Active; Price: 0.01; Resistance: 330 Ohms; Series: CRGH, Neohm; Size / Dimension: 0.063" L x 0.031" W (1.60mm x 0.80mm); Supplier 1: DigiKey; Supplier Part Number 1: A129541CT-ND; Supplier Device Package: 0603; Tolerance: ±1%
R30 R31 = PMR25HZPFV2L00: RES 0.002 OHM 1% 1W 1210; Manufacturer: Rohm Semiconductor; Temperature Coefficient: ±100ppm/°C; Part Number: PMR25HZPFV2L00; ComponentLink1Description: Datasheet; ComponentLink1URL: https://www.rohm.com/datasheet/PMR18EZPFV/pmr-e; ComponentLink2Description: DigiKey Link; ComponentLink2URL: http://digikey.com/product-detail/en/rohm-semiconductor/PMR25HZPFV2L00/RHM.002APCT-ND/2094531; Composition: Thick Film; Device Package: 1210 (3225 Metric); Features: Automotive AEC-Q200, Current Sense; Height - Seated (Max): 0.019" (0.47mm); LastUpdated: 8/30/2020 9:05:59 PM; Lifecycle Status: Active; Minimum Order: 1; Number of Terminations: 2; Operating Temperature: -55°C ~ 155°C; Package / Case: 1210 (3225 Metric); Packaging: TapeAndReel; Part Status: Active; Power (Watts): 1W; Price: 0.19; Ratings: AEC-Q200; Resistance: 2 mOhms; Series: PMR; Size / Dimension: 0.126" L x 0.098" W (3.20mm x 2.50mm); Supplier 1: DigiKey; Supplier Part Number 1: RHM.002APCT-ND; Supplier Device Package: 1210; Tolerance: ±1%; Value: 2 mOhms
R38 R39 = CRCW06030000Z0EAHP: RES SMD 0 OHM JUMPER 1/4W 0603; Manufacturer: Vishay Dale; Power (Watts): 0.25W, 1/4W; Part Number: CRCW06030000Z0EAHP; Value: 0 Ohms; ComponentLink1Description: Datasheet; ComponentLink1URL: http://www.vishay.com/docs/20043/crcwhpe3.pdf; ComponentLink2Description: DigiKey Link; ComponentLink2URL: http://digikey.com/product-detail/en/vishay-dale/CRCW06030000Z0EAHP/541-0.0SBCT-ND/2222749; Composition: Thick Film; Device Package: 0603 (1608 Metric); Features: Automotive AEC-Q200, Pulse Withstanding; Height - Seated (Max): 0.022" (0.55mm); LastUpdated: 9/2/2020 1:10:23 AM; Lifecycle Status: Active; Minimum Order: 1; Number of Terminations: 2; Operating Temperature: -55°C ~ 155°C; Package / Case: 0603 (1608 Metric); Packaging: TapeAndReel; PartId: 5474; Part Status: Active; Price: 0.02; Ratings: AEC-Q200; Resistance: 0 Ohms; Series: CRCW-HP; Size / Dimension: 0.063" L x 0.033" W (1.60mm x 0.85mm); Supplier 1: DigiKey; Supplier Part Number 1: 541-0.0SBCT-ND; Supplier Device Package: 0603; Tolerance: Jumper
R43 = CRM2512-FX-R250ELF: RES 0.25 OHM 1% 2W 2512; Manufacturer: Bourns Inc.; Temperature Coefficient: ±100ppm/°C; Part Number: CRM2512-FX-R250ELF; ComponentLink1Description: Datasheet; ComponentLink1URL: https://www.bourns.com/docs/Product-Datasheets/CRM.pdf; ComponentLink2Description: DigiKey Link; ComponentLink2URL: http://digikey.com/product-detail/en/bourns-inc/CRM2512-FX-R250ELF/CRM2512-FX-R250ELFCT-ND/9677734; Composition: Thick Film; Device Package: 2512 (6432 Metric); Features: Current Sense; Height - Seated (Max): 0.031" (0.80mm); LastUpdated: 9/2/2020 1:26:51 AM; Lifecycle Status: Active; Minimum Order: 1; Number of Terminations: 2; Operating Temperature: -55°C ~ 155°C; Package / Case: 2512 (6432 Metric); Packaging: TapeAndReel; Part Status: Active; Power (Watts): 2W; Price: 0.30; Resistance: 250 mOhms; Series: CRM2512; Size / Dimension: 0.248" L x 0.122" W (6.30mm x 3.10mm); Supplier 1: DigiKey; Supplier Part Number 1: CRM2512-FX-R250ELFCT-ND; Supplier Device Package: 2512; Tolerance: ±1%; Value: 250 mOhms
S1 S2 = 1977223-9: SWITCH TACTILE SPST-NO 0.05A 24V; Manufacturer: TE Connectivity ALCOSWITCH Switches; Actuator Height off PCB, Vertical: 5.00mm; Actuator Orientation: Top Actuated; Actuator Type: Standard; Contact Rating @ Voltage: 0.05A @ 24VDC; Illumination: Non-Illuminated; Operating Force: 160gf; Outline: 6.00mm x 6.00mm; Switch Function: Off-Mom; Part Number: 1977223-9; Circuit: SPST-NO; ComponentLink1Description: Datasheet; ComponentLink1URL: https://www.te.com/commerce/DocumentDelivery/DDEController?Action=srchrtrv&DocNm=1308111-1_SWITCHES_CORE_PROGRAM_CATALOG&DocType=CS&DocLang=English; ComponentLink2Description: DigiKey Link; ComponentLink2URL: http://digikey.com/product-detail/en/te-connectivity-alcoswitch-switches/1977223-9/1977223-9-ND/5597033; LastUpdated: 8/30/2020 9:06:45 PM; Lifecycle Status: Active; Minimum Order: 30000; Mounting Type: Surface Mount; Packaging: Bulk; Price: 0.16; Series: FSMJSMA; Supplier 1: DigiKey; Supplier Part Number 1: 1977223-9-ND; Termination Style: Gull Wing